# EAGLE schematic led driver (EAGLE 7.2.0)
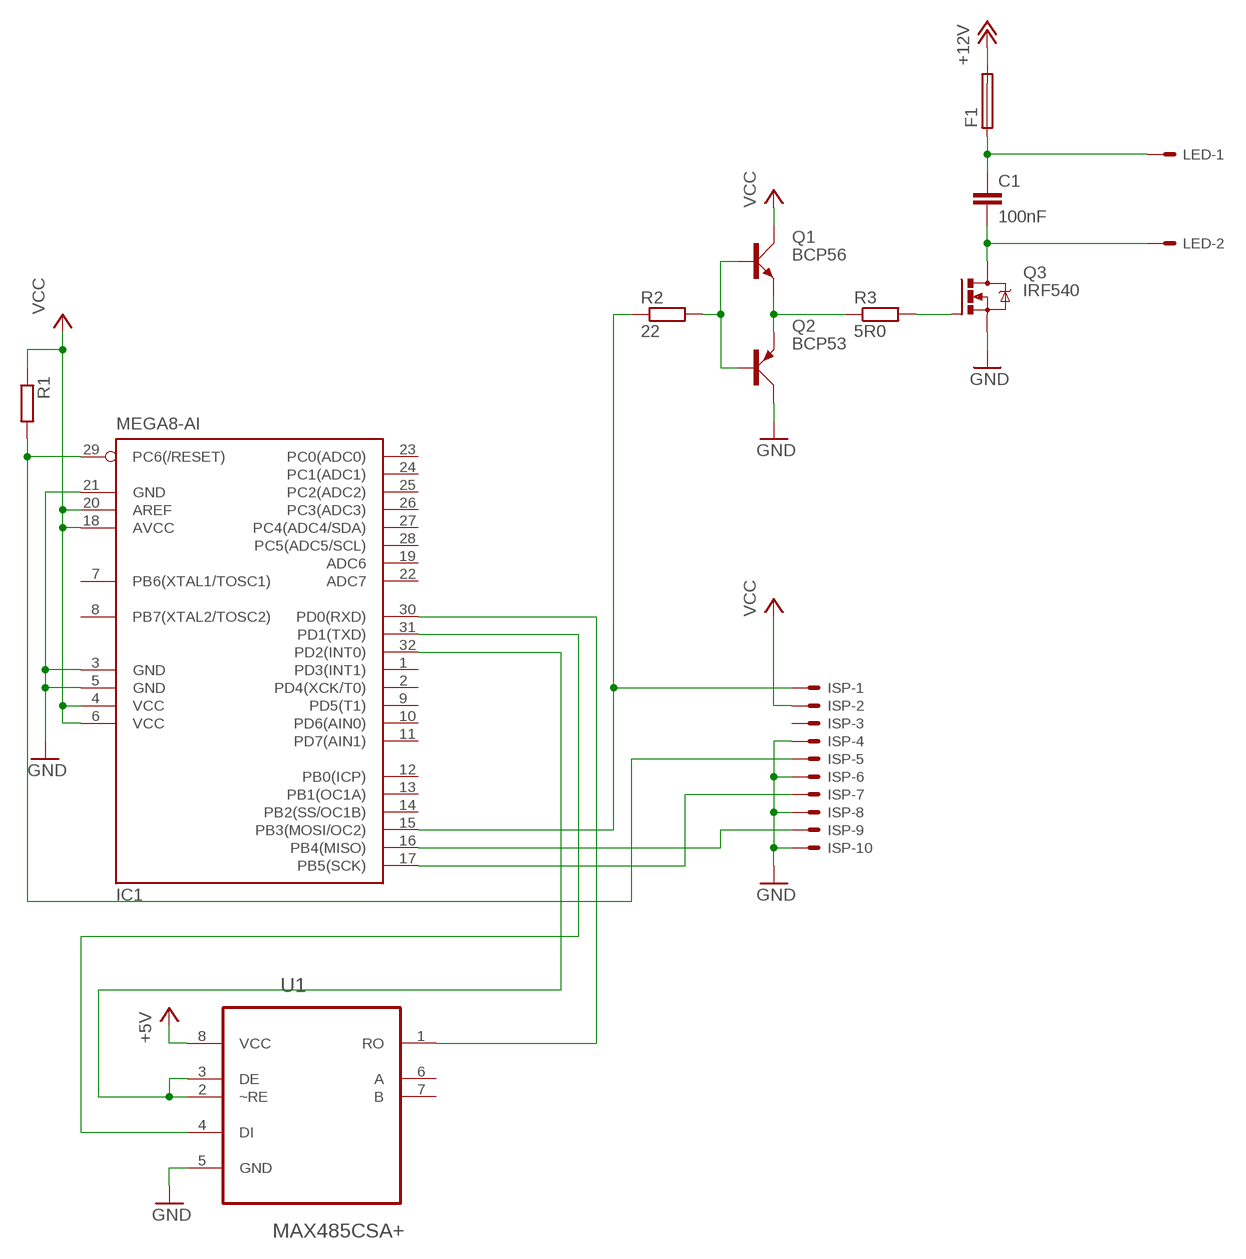
[diagram p0: schematic, sheet 1]

## Parts
C1  100nF  C2,5-3  [C2.5-3]
F1  TE5  [TE5]
IC1  MEGA8-AI  [TQFP32-08]
ISP  5566-10  [5566-10]
LED  5566-10  [5566-10]
Q1  BCP56  BC639  [SOT54D]
Q2  BCP53  BC640  [SOT54D]
Q3  IRF540  [TO220BV]
R1  R-EU_M1206  [M1206]
R2  22  R-EU_R1206  [R1206]
R3  5R0  R-EU_R1206  [R1206]
U1  MAX485CSA+  [SOIC127P600X175-8N]

## Nets
+5V: U1.8(VCC)
+12V: F1.2
GND: IC1.3(GND) IC1.5(GND) IC1.21(GND) ISP.4 ISP.6 ISP.8 ISP.10 Q2.C Q3.S U1.5(GND)
N$1: IC1.31(PD1(TXD)) U1.4(DI)
N$2: IC1.30(PD0(RXD)) U1.1(RO)
N$3: IC1.32(PD2(INT0)) U1.2(~RE) U1.3(DE)
N$4: IC1.17(PB5(SCK)) ISP.7
N$5: Q1.B Q2.B R2.2
N$6: IC1.15(PB3(MOSI/OC2)) ISP.1 R2.1
N$7: IC1.16(PB4(MISO)) ISP.9
N$8: Q1.E Q2.E R3.1
N$9: Q3.G R3.2
N$10: C1.2 LED.2 Q3.D
N$11: IC1.29(PC6(/RESET)) ISP.5 R1.2
N$13: C1.1 F1.1 LED.1
VCC: IC1.4(VCC) IC1.6(VCC) IC1.18(AVCC) IC1.20(AREF) ISP.2 Q1.C R1.1
Unconnected: IC1.1(PD3(INT1)) IC1.2(PD4(XCK/T0)) IC1.7(PB6(XTAL1/TOSC1)) IC1.8(PB7(XTAL2/TOSC2)) IC1.9(PD5(T1)) IC1.10(PD6(AIN0)) IC1.11(PD7(AIN1)) IC1.12(PB0(ICP)) IC1.13(PB1(OC1A)) IC1.14(PB2(SS/OC1B)) IC1.19(ADC6) IC1.22(ADC7) IC1.23(PC0(ADC0)) IC1.24(PC1(ADC1)) IC1.25(PC2(ADC2)) IC1.26(PC3(ADC3)) IC1.27(PC4(ADC4/SDA)) IC1.28(PC5(ADC5/SCL)) ISP.3 LED.3 LED.4 LED.5 LED.6 LED.7 LED.8 LED.9 LED.10 U1.6(A) U1.7(B)

## Library data of the parts
C1 = capacitor-wima:C: CAPACITOR naming: grid - package width
F1 = fuse:TE5: FUSE Wickmann; OC_FARNELL: unknown; OC_NEWARK: unknown
IC1 = atmel:MEGA8: MICROCONTROLLER 8 Kbytes FLASH, 1 kbytes SRAM, 512 bytes EEPROM, USART, 6-channel 10 bit ADC, 2-channel 8 bit ADC Pin compatible with Atmega48, ATMega88, ATMega168 Source: avr.lbr; MPN: ATMEGA8-16AU; OC_FARNELL: 9171371; OC_NEWARK: 73M8863
ISP LED = con-molex:5566-10: Mini FIT connector 10 pol Source: http://www.molex.com; OC_FARNELL: unknown; OC_NEWARK: unknown
Q1 = transistor-small-signal:BC639: NPN TRANSISTOR
Q2 = transistor-small-signal:BC640: PNP TRANSISTOR
Q3 = transistor-power:IRF540: HEXFET Power MOSFET
R1-R3 = resistor:R-EU_: RESISTOR, European symbol
U1 = Maxim_By_element14_Batch_1:MAX485CSA+: ±15kV ESD-Protected, Slew-Rate-Limited, Low-Power, RS-485/RS-422 Transceivers; MPN: MAX485CSA+; OC_FARNELL: 9725954; OC_NEWARK: 68K4795; PACKAGE: SOIC-8; SUPPLIER: Maxim